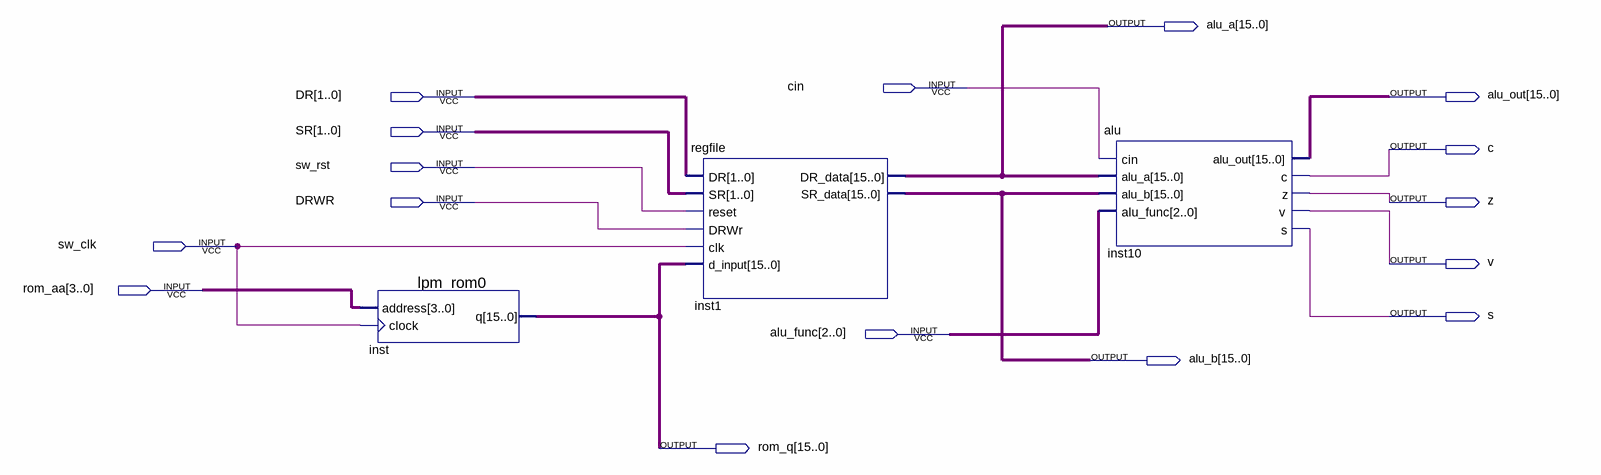
[diagram p0: schematic sheet]
// Quartus schematic rt11_cz12.bdf as structural Verilog: 3 symbols, 16 pins
module rt11_cz12 (
  input  cin,
  input  [1:0] DR,
  input  [1:0] SR,
  input  sw_rst,
  input  DRWR,
  input  sw_clk,
  input  [3:0] rom_aa,
  input  [2:0] alu_func,
  output [15:0] alu_a,
  output [15:0] alu_out,
  output c,
  output z,
  output v,
  output s,
  output [15:0] alu_b,
  output [15:0] rom_q
);

  lpm_rom0 inst (.address(rom_aa), .clock(sw_clk), .q(rom_q));
  regfile inst1 (
    .DR(DR), .SR(SR), .reset(sw_rst), .DRWr(DRWR), .clk(sw_clk), .d_input(rom_q), .DR_data(alu_a),
    .SR_data(alu_b));
  alu inst10 (
    .cin(cin), .alu_a(alu_a), .alu_b(alu_b), .alu_func(alu_func), .alu_out(alu_out), .c(c), .z(z), .v(v),
    .s(s));
endmodule
